# Altium schematic sheet fpga.SchDoc
size A2
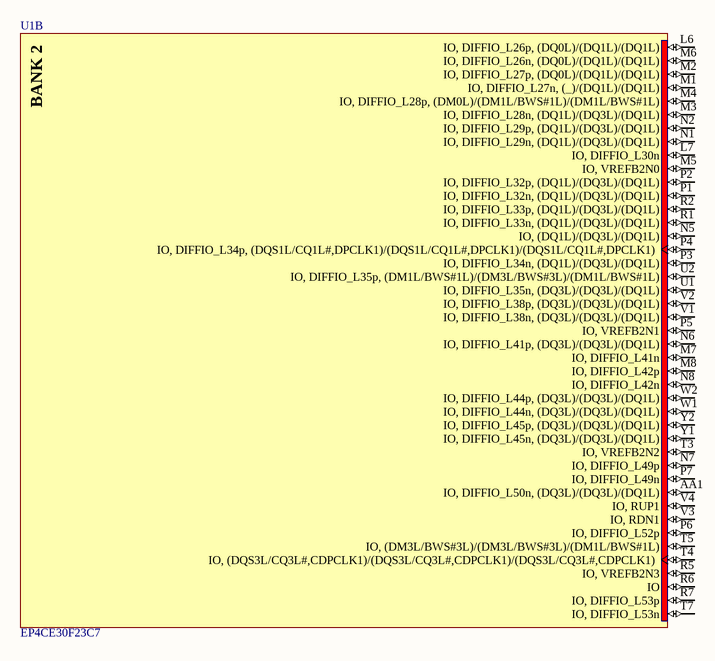
[diagram p0: fpga.SchDoc]

## Parts
U1  EP4CE30F23C7  [FBGA484]  (part B of 13)

## Nets

Not connected (* = marked no-connect by the designer): U1 AA1(IO,_DIFFIO_L50n,_(DQ3L)/(DQ3L)/(DQ1L)) L6(IO,_DIFFIO_L26p,_(DQ0L)/(DQ1L)/(DQ1L)) L7(IO,_DIFFIO_L30n) M1(IO,_DIFFIO_L27n,_(_)/(DQ1L)/(DQ1L)) M2(IO,_DIFFIO_L27p,_(DQ0L)/(DQ1L)/(DQ1L)) M3(IO,_DIFFIO_L28n,_(DQ1L)/(DQ3L)/(DQ1L)) M4(IO,_DIFFIO_L28p,_(DM0L)/(DM1L/BWS#1L)/(DM1L/BWS#1L)) M5(IO,_VREFB2N0) M6(IO,_DIFFIO_L26n,_(DQ0L)/(DQ1L)/(DQ1L)) M7(IO,_DIFFIO_L41n) M8(IO,_DIFFIO_L42p) N1(IO,_DIFFIO_L29n,_(DQ1L)/(DQ3L)/(DQ1L)) N2(IO,_DIFFIO_L29p,_(DQ1L)/(DQ3L)/(DQ1L)) N5(IO,_(DQ1L)/(DQ3L)/(DQ1L)) N6(IO,_DIFFIO_L41p,_(DQ3L)/(DQ3L)/(DQ1L)) N7(IO,_DIFFIO_L49p) N8(IO,_DIFFIO_L42n) P1(IO,_DIFFIO_L32n,_(DQ1L)/(DQ3L)/(DQ1L)) P2(IO,_DIFFIO_L32p,_(DQ1L)/(DQ3L)/(DQ1L)) P3(IO,_DIFFIO_L34n,_(DQ1L)/(DQ3L)/(DQ1L)) P4(IO,_DIFFIO_L34p,_(DQS1L/CQ1L#,DPCLK1)/(DQS1L/CQ1L#,DPCLK1)/(DQS1L/CQ1L#,DPCLK1)) P5(IO,_VREFB2N1) P6(IO,_DIFFIO_L52p) P7(IO,_DIFFIO_L49n) R1(IO,_DIFFIO_L33n,_(DQ1L)/(DQ3L)/(DQ1L)) R2(IO,_DIFFIO_L33p,_(DQ1L)/(DQ3L)/(DQ1L)) R5(IO,_VREFB2N3) R6(IO) R7(IO,_DIFFIO_L53p) T3(IO,_VREFB2N2) T4(IO,_(DQS3L/CQ3L#,CDPCLK1)/(DQS3L/CQ3L#,CDPCLK1)/(DQS3L/CQ3L#,CDPCLK1)) T5(IO,_(DM3L/BWS#3L)/(DM3L/BWS#3L)/(DM1L/BWS#1L)) T7(IO,_DIFFIO_L53n) U1(IO,_DIFFIO_L35n,_(DQ3L)/(DQ3L)/(DQ1L)) U2(IO,_DIFFIO_L35p,_(DM1L/BWS#1L)/(DM3L/BWS#3L)/(DM1L/BWS#1L)) V1(IO,_DIFFIO_L38n,_(DQ3L)/(DQ3L)/(DQ1L)) V2(IO,_DIFFIO_L38p,_(DQ3L)/(DQ3L)/(DQ1L)) V3(IO,_RDN1) V4(IO,_RUP1) W1(IO,_DIFFIO_L44n,_(DQ3L)/(DQ3L)/(DQ1L)) W2(IO,_DIFFIO_L44p,_(DQ3L)/(DQ3L)/(DQ1L)) Y1(IO,_DIFFIO_L45n,_(DQ3L)/(DQ3L)/(DQ1L)) Y2(IO,_DIFFIO_L45p,_(DQ3L)/(DQ3L)/(DQ1L))

## Notes on the sheet
- (in symbol EP4CE30F23C7, part B) BANK 2

## Library data of the parts
U1 = EP4CE30F23C7: Cyclone IV Family FPGA, 2V Core, 328 I/O Pins, 4 PLLs, 484-Pin FBGA, Speed Grade 7, Commercial Grade; Published: 3-May-2010; DatasheetVersion: ver1.2, Mar-2010; PackageVersion: ver16.0, Dec-2009; PackageReference: FBGA484; Publisher: Altium Limited; PackageDescription: 484-Ball FineLine Ball Grid Array (FBGA484) - Flip Chip; Supplier 1: Digi-Key; Supplier Part Number 1: EP4CE30F23C7-ND; Code_JEDEC: MS-034-AAJ-1; Code_IPC: BGA100P22X22-484; ComponentLink1Description: Manufacturer Link; ComponentLink1URL: http://www.altera.com/; ComponentLink2Description: Handbook; ComponentLink2URL: http://www.altera.com/literature/hb/cyclone-iv/cyclone4-handbook.pdf; ComponentLink3Description: Pinout Specification; ComponentLink3URL: http://www.altera.com/literature/lit-dp.jsp?category=cyc%204&showspreadsheet=y; ComponentLink4Description: Packaging Specification; ComponentLink4URL: http://www.altera.com/literature/ds/dspkg.pdf